# Altium schematic sheet DDS.SchDoc
size A2
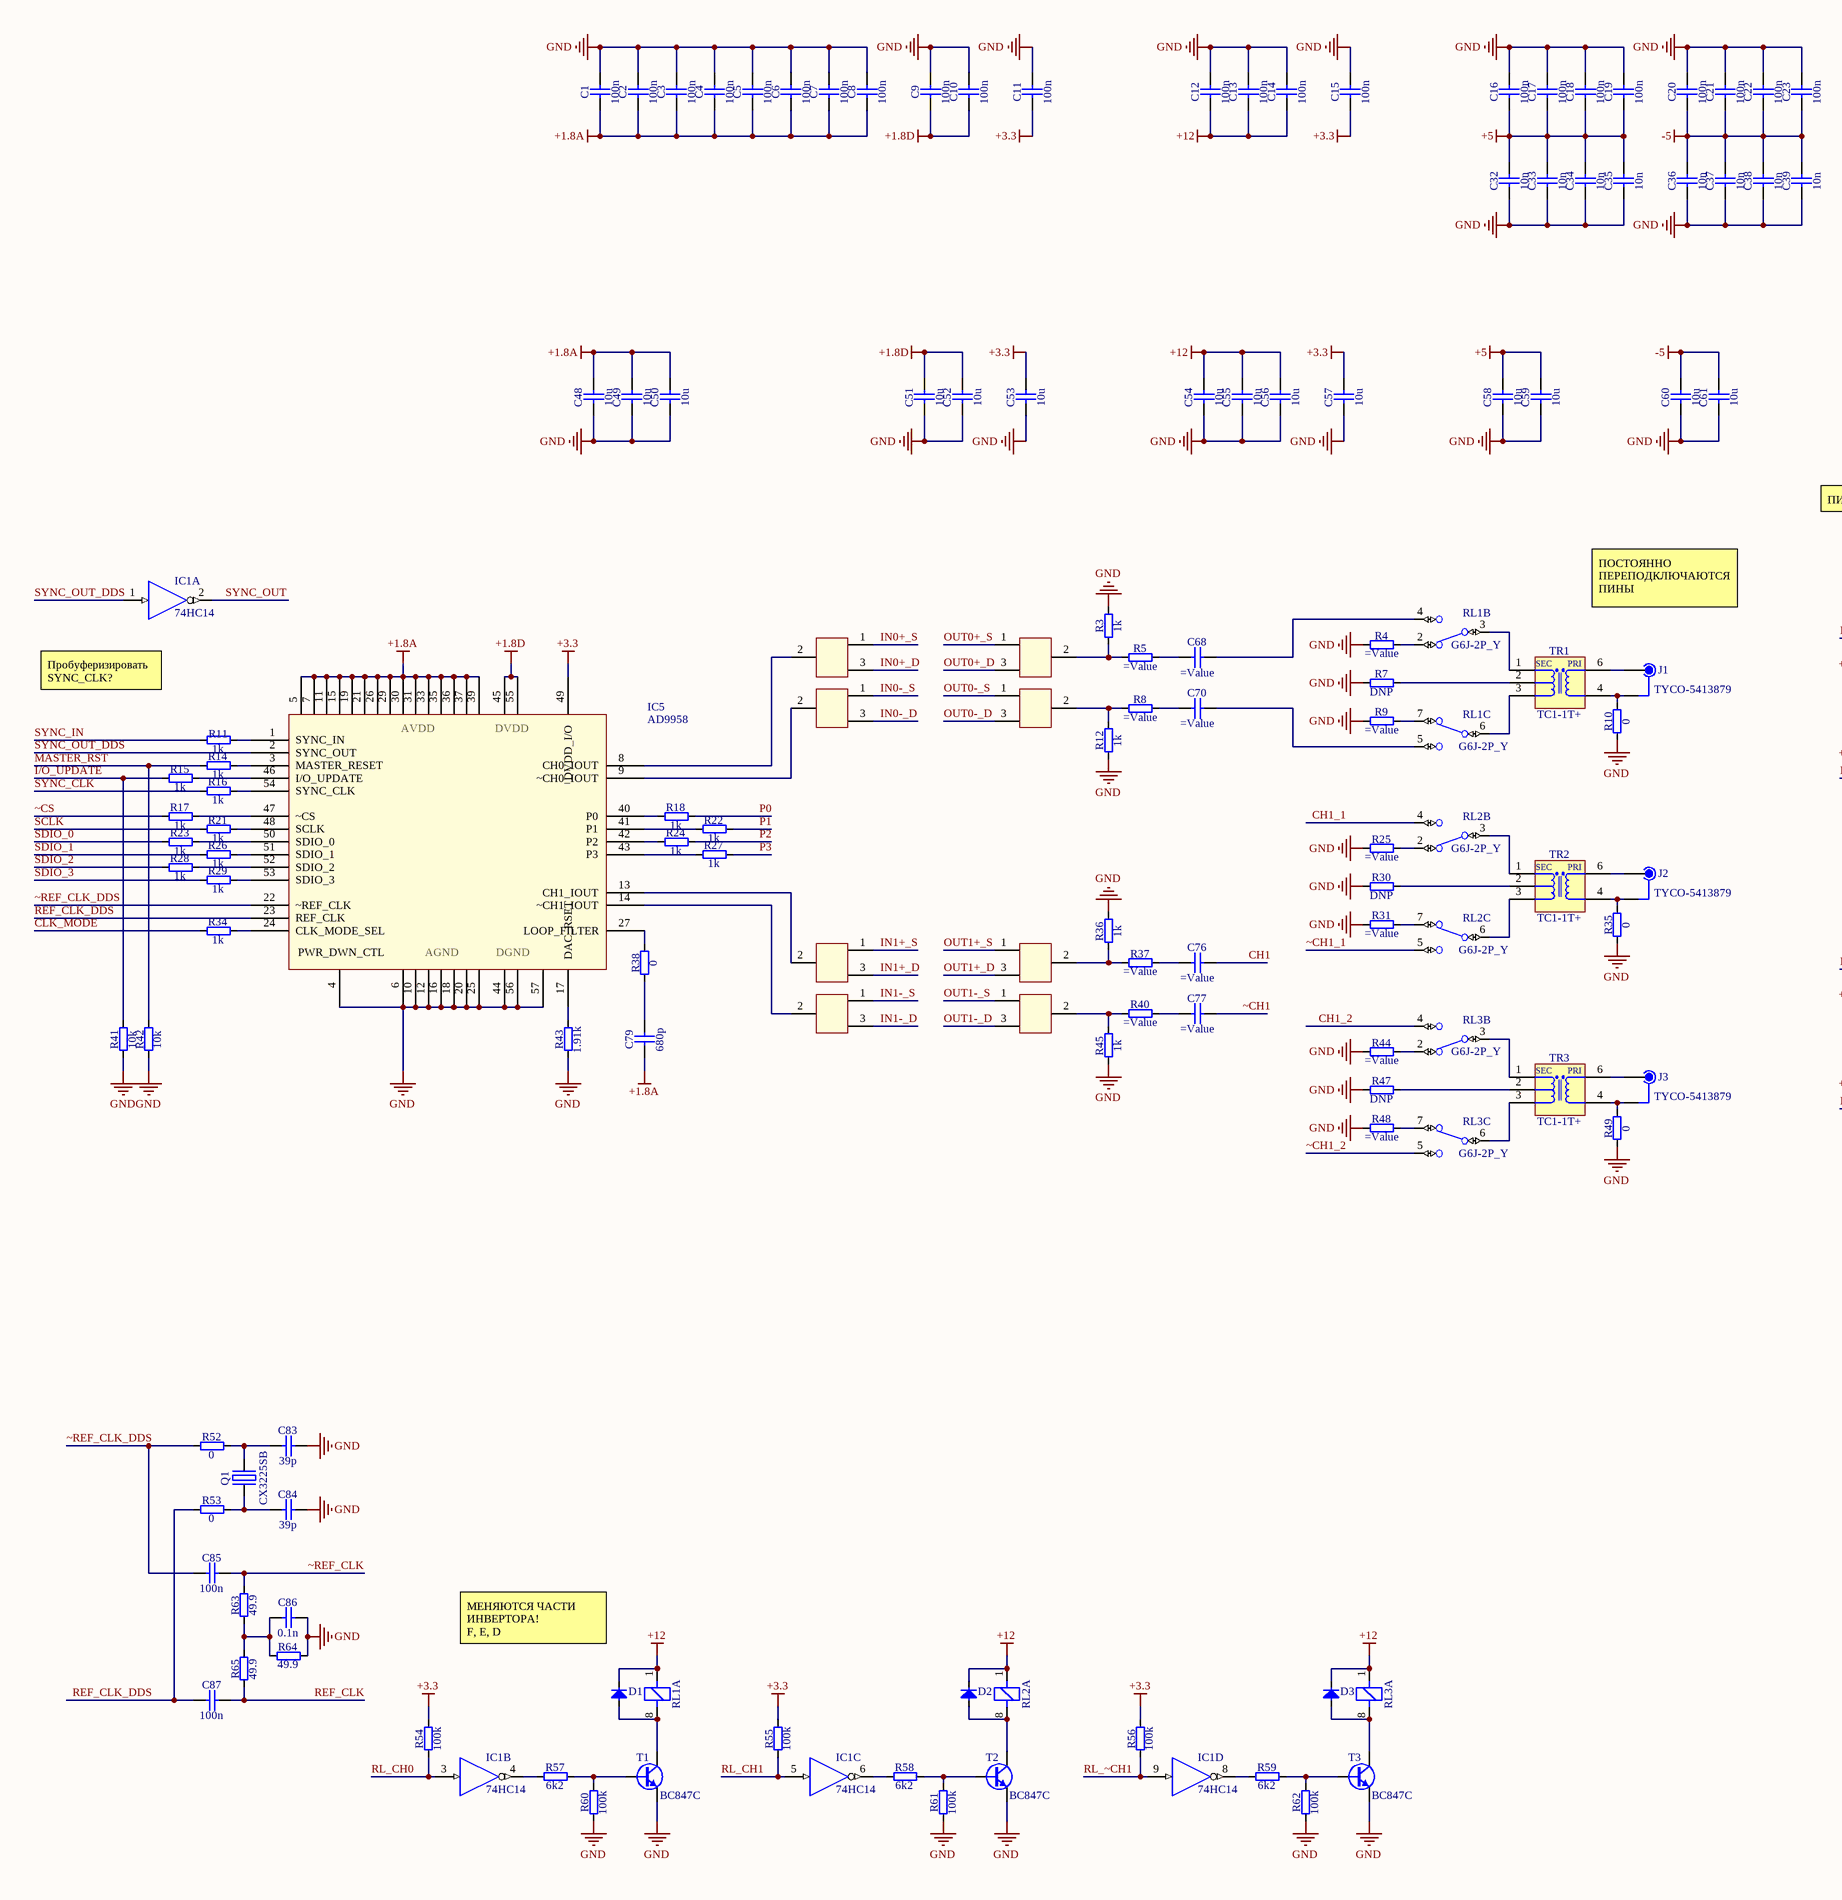
[diagram p0: DDS.SchDoc, left]
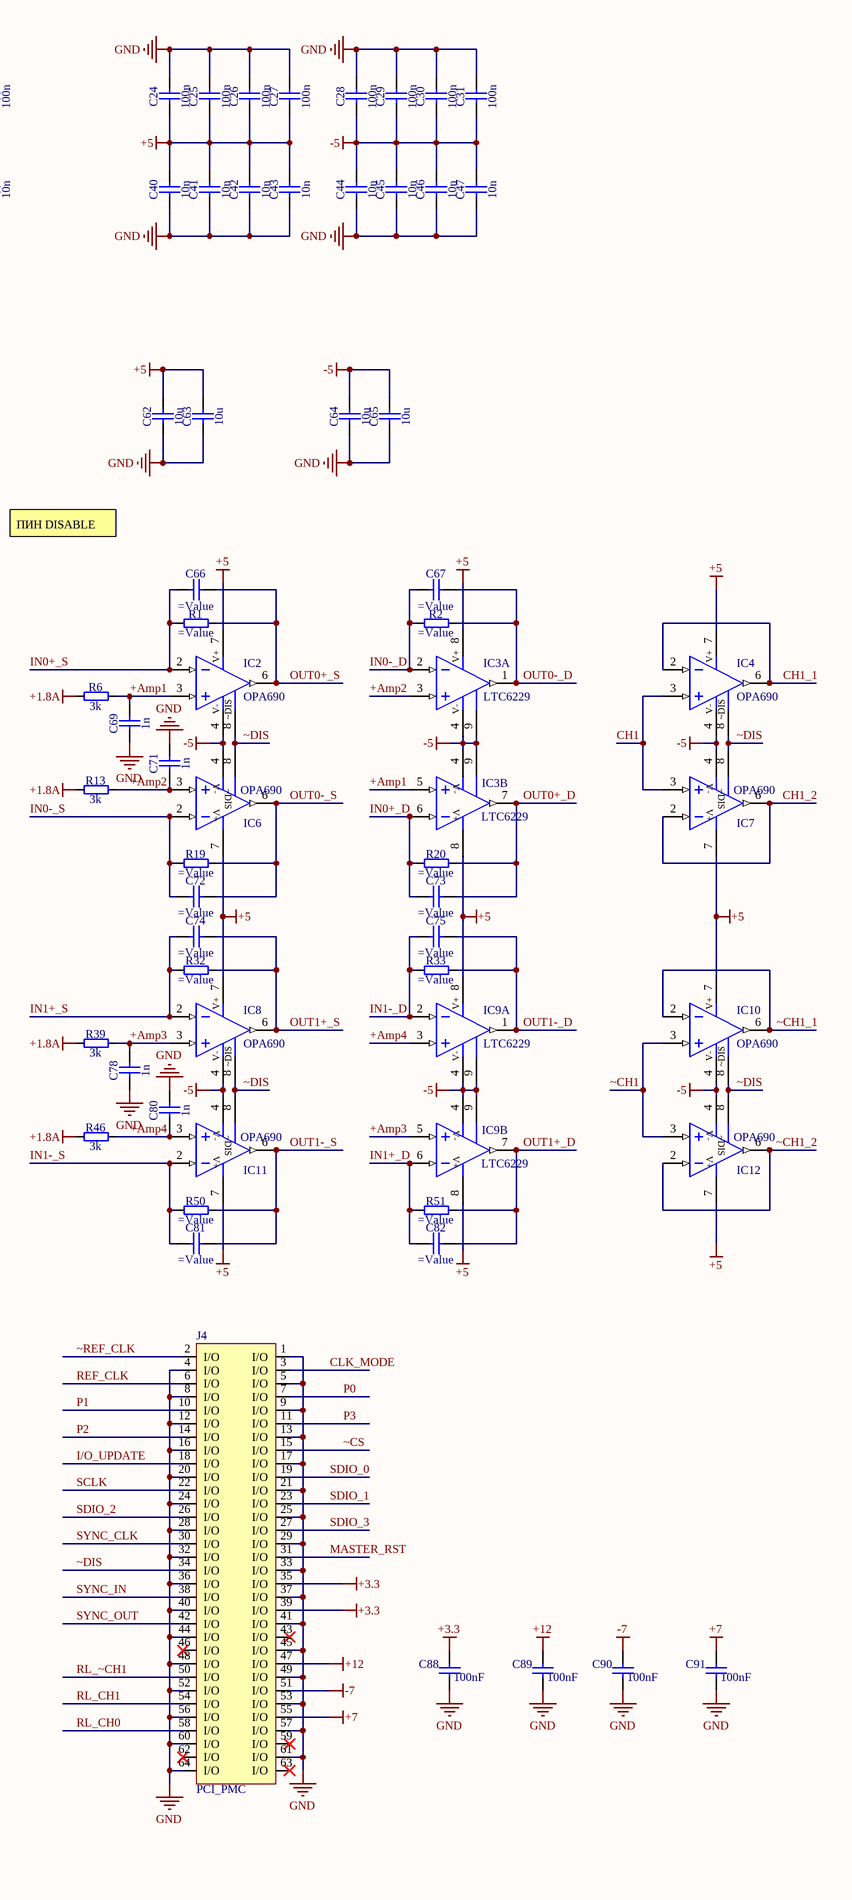
[diagram p1: DDS.SchDoc, right]

## Parts
1  Jumper  [Jumper]  (value not drawn)
2  Jumper  [Jumper]  (value not drawn)
3  Jumper  [Jumper]  (value not drawn)
4  Jumper  [Jumper]  (value not drawn)
5  Jumper  [Jumper]  (value not drawn)
6  Jumper  [Jumper]  (value not drawn)
7  Jumper  [Jumper]  (value not drawn)
8  Jumper  [Jumper]  (value not drawn)
C1  100n  [0603]
C2  100n  [0603]
C3  100n  [0603]
C4  100n  [0603]
C5  100n  [0603]
C6  100n  [0603]
C7  100n  [0603]
C8  100n  [0603]
C9  100n  [0603]
C10  100n  [0603]
C11  100n  [0603]
C12  100n  [0603]
C13  100n  [0603]
C14  100n  [0603]
C15  100n  [0603]
C16  100n  [0603]
C17  100n  [0603]
C18  100n  [0603]
C19  100n  [0603]
C20  100n  [0603]
C21  100n  [0603]
C22  100n  [0603]
C23  100n  [0603]
C24  100n  [0603]
C25  100n  [0603]
C26  100n  [0603]
C27  100n  [0603]
C28  100n  [0603]
C29  100n  [0603]
C30  100n  [0603]
C31  100n  [0603]
C32  10n  [0603]
C33  10n  [0603]
C34  10n  [0603]
C35  10n  [0603]
C36  10n  [0603]
C37  10n  [0603]
C38  10n  [0603]
C39  10n  [0603]
C40  10n  [0603]
C41  10n  [0603]
C42  10n  [0603]
C43  10n  [0603]
C44  10n  [0603]
C45  10n  [0603]
C46  10n  [0603]
C47  10n  [0603]
C48  10u  [0603]
C49  10u  [0603]
C50  10u  [0603]
C51  10u  [0603]
C52  10u  [0603]
C53  10u  [0603]
C54  10u  [0603]
C55  10u  [0603]
C56  10u  [0603]
C57  10u  [0603]
C58  10u  [0603]
C59  10u  [0603]
C60  10u  [0603]
C61  10u  [0603]
C62  10u  [0603]
C63  10u  [0603]
C64  10u  [0603]
C65  10u  [0603]
C66  (no value)  [0805]
C67  (no value)  [0805]
C68  (no value)  [0603]
C69  1n  [0603]
C70  (no value)  [0603]
C71  1n  [0603]
C72  (no value)  [0805]
C73  (no value)  [0805]
C74  (no value)  [0805]
C75  (no value)  [0805]
C76  (no value)  [0603]
C77  (no value)  [0603]
C78  1n  [0603]
C79  680p  [0603]
C80  1n  [0603]
C81  (no value)  [0805]
C82  (no value)  [0805]
C83  39p  [0603]
C84  39p  [0603]
C85  100n  [0603]
C86  0.1n  [0805]
C87  100n  [0603]
C88  100nF  [0805]
C89  100nF  [0805]
C90  100nF  [0805]
C91  100nF  [0805]
D1  Diode  [SODFL1608X65N]  (value not drawn)
D2  Diode  [SODFL1608X65N]  (value not drawn)
D3  Diode  [SODFL1608X65N]  (value not drawn)
IC1  74HC14  [SOIC127P600X175-14N]  (parts A,B,C,D of 6)
IC2  OPA690  [SOIC127P600X175-8N]
IC3  LTC6229  [SOP65P490X110-9N-R168X188]  (parts A,B of 2)
IC4  OPA690  [SOIC127P600X175-8N]
IC5  AD9958  [QFN50P800X800X80-57N-S670]
IC6  OPA690  [SOIC127P600X175-8N]
IC7  OPA690  [SOIC127P600X175-8N]
IC8  OPA690  [SOIC127P600X175-8N]
IC9  LTC6229  [SOP65P490X110-9N-R168X188]  (parts A,B of 2)
IC10  OPA690  [SOIC127P600X175-8N]
IC11  OPA690  [SOIC127P600X175-8N]
IC12  OPA690  [SOIC127P600X175-8N]
J1  TYCO-5413879  [TYCO_1-5413879]
J2  TYCO-5413879  [TYCO_1-5413879]
J3  TYCO-5413879  [TYCO_1-5413879]
J4  PCI_PMC  [TYCO_120527-1]
Q1  CX3225SB  [XTAL_KYOCERA_CX3225SB]
R1  (no value)  [0805]
R2  (no value)  [0805]
R3  1k  [0603]
R4  (no value)  [0603]
R5  (no value)  [0603]
R6  3k  [0603]
R7  DNP  [0603]
R8  (no value)  [0603]
R9  (no value)  [0603]
R10  0  [0603]
R11  1k  [0603]
R12  1k  [0603]
R13  3k  [0603]
R14  1k  [0603]
R15  1k  [0603]
R16  1k  [0603]
R17  1k  [0603]
R18  1k  [0603]
R19  (no value)  [0805]
R20  (no value)  [0805]
R21  1k  [0603]
R22  1k  [0603]
R23  1k  [0603]
R24  1k  [0603]
R25  (no value)  [0603]
R26  1k  [0603]
R27  1k  [0603]
R28  1k  [0603]
R29  1k  [0603]
R30  DNP  [0603]
R31  (no value)  [0603]
R32  (no value)  [0805]
R33  (no value)  [0805]
R34  1k  [0603]
R35  0  [0603]
R36  1k  [0603]
R37  (no value)  [0603]
R38  0  [0603]
R39  3k  [0603]
R40  (no value)  [0603]
R41  10k  [0603]
R42  10k  [0603]
R43  1.91k  [0603]
R44  (no value)  [0603]
R45  1k  [0603]
R46  3k  [0603]
R47  DNP  [0603]
R48  (no value)  [0603]
R49  0  [0603]
R50  (no value)  [0805]
R51  (no value)  [0805]
R52  0  [0603]
R53  0  [0603]
R54  100k  [0603]
R55  100k  [0603]
R56  100k  [0603]
R57  6k2  [0805]
R58  6k2  [0805]
R59  6k2  [0805]
R60  100k  [0603]
R61  100k  [0603]
R62  100k  [0603]
R63  49.9  [0805]
R64  49.9  [0805]
R65  49.9  [0805]
RL1  G6J-2P_Y  [G6J-2P-Y]  (value not drawn)  (parts A,B,C of 3)
RL2  G6J-2P_Y  [G6J-2P-Y]  (value not drawn)  (parts A,B,C of 3)
RL3  G6J-2P_Y  [G6J-2P-Y]  (value not drawn)  (parts A,B,C of 3)
T1  BC847C  [SOT95P230X110-3N]
T2  BC847C  [SOT95P230X110-3N]
T3  BC847C  [SOT95P230X110-3N]
TR1  TC1-1T+  [AT224-1]
TR2  TC1-1T+  [AT224-1]
TR3  TC1-1T+  [AT224-1]

## Nets
+1.8A: C1.1 C2.1 C3.1 C4.1 C5.1 C6.1 C7.1 C8.1 C48.2 C49.2 C50.2 C79.1 IC5.5 IC5.7 IC5.11 IC5.15 IC5.19 IC5.21 IC5.26 IC5.29 IC5.30 IC5.31 IC5.33 IC5.35 IC5.36 IC5.37 IC5.39 R6.1 R13.1 R39.1 R46.1
+1.8D: C9.1 C10.1 C51.2 C52.2 IC5.45 IC5.55
+3.3: C11.1 C15.1 C53.2 C57.2 C88.2 IC1.14(VCC) IC5.49(DVDD_I/O) J4.35(I/O) J4.39(I/O) R54.2 R55.2 R56.2
+5: C16.1 C17.1 C18.1 C19.1 C24.1 C25.1 C26.1 C27.1 C32.2 C33.2 C34.2 C35.2 C40.2 C41.2 C42.2 C43.2 C58.2 C59.2 C62.2 C63.2 IC2.7(V+) IC3.8(V+) IC4.7(V+) IC6.7(V+) IC7.7(V+) IC8.7(V+) IC9.8(V+) IC10.7(V+) IC11.7(V+) IC12.7(V+)
+7: C91.2 J4.55(I/O)
+12: C12.1 C13.1 C14.1 C54.2 C55.2 C56.2 C89.2 D1.1(C) D2.1(C) D3.1(C) J4.47(I/O) RL1.1 RL2.1 RL3.1
-5: C20.1 C21.1 C22.1 C23.1 C28.1 C29.1 C30.1 C31.1 C36.2 C37.2 C38.2 C39.2 C44.2 C45.2 C46.2 C47.2 C60.2 C61.2 C64.2 C65.2 IC2.4(V-) IC3.4(V-) IC3.9 IC4.4(V-) IC6.4(V-) IC7.4(V-) IC8.4(V-) IC9.4(V-) IC9.9 IC10.4(V-) IC11.4(V-) IC12.4(V-)
-7: C90.2 J4.51(I/O)
GND: C1.2 C2.2 C3.2 C4.2 C5.2 C6.2 C7.2 C8.2 C9.2 C10.2 C11.2 C12.2 C13.2 C14.2 C15.2 C16.2 C17.2 C18.2 C19.2 C20.2 C21.2 C22.2 C23.2 C24.2 C25.2 C26.2 C27.2 C28.2 C29.2 C30.2 C31.2 C32.1 C33.1 C34.1 C35.1 C36.1 C37.1 C38.1 C39.1 C40.1 C41.1 C42.1 C43.1 C44.1 C45.1 C46.1 C47.1 C48.1 C49.1 C50.1 C51.1 C52.1 C53.1 C54.1 C55.1 C56.1 C57.1 C58.1 C59.1 C60.1 C61.1 C62.1 C63.1 C64.1 C65.1 C69.1 C71.2 C78.1 C80.2 C83.2 C84.2 C86.2 C88.1 C89.1 C90.1 C91.1 IC1.7(GND) IC5.4(PWR_DWN_CTL) IC5.6 IC5.10 IC5.12 IC5.16 IC5.18 IC5.20 IC5.25 IC5.44 IC5.56 IC5.57 J1.2 J2.2 J3.2 J4.1(I/O) J4.4(I/O) J4.5(I/O) J4.8(I/O) J4.9(I/O) J4.12(I/O) J4.13(I/O) J4.16(I/O) J4.17(I/O) J4.20(I/O) J4.21(I/O) J4.24(I/O) J4.25(I/O) J4.28(I/O) J4.29(I/O) J4.32(I/O) J4.33(I/O) J4.36(I/O) J4.37(I/O) J4.40(I/O) J4.41(I/O) J4.44(I/O) J4.45(I/O) J4.48(I/O) J4.49(I/O) J4.52(I/O) J4.53(I/O) J4.56(I/O) J4.57(I/O) J4.60(I/O) J4.61(I/O) J4.64(I/O) Q1.2(GND) Q1.4(GND) R3.2 R4.1 R7.1 R9.1 R10.1 R12.1 R25.1 R30.1 R31.1 R35.1 R36.2 R41.1 R42.1 R43.1 R44.1 R45.1 R47.1 R48.1 R49.1 R60.1 R61.1 R62.1 R64.2 T1.2(E) T2.2(E) T3.2(E)
+Amp1: C69.2 IC2.3(IN+) IC3.5(IN+) R6.2
+Amp2: C71.1 IC3.3(IN+) IC6.3(IN+) R13.2
+Amp3: C78.2 IC8.3(IN+) IC9.5(IN+) R39.2
+Amp4: C80.1 IC9.3(IN+) IC11.3(IN+) R46.2
CH1: C76.2 IC4.3(IN+) IC7.3(IN+)
CH1_1: IC4.2(IN-) IC4.6(OUT) RL2.4(NO)
CH1_2: IC7.2(IN-) IC7.6(OUT) RL3.4(NO)
CLK_MODE: J4.3(I/O) R34.1
I/O_UPDATE: J4.18(I/O) R15.1 R41.2
IN0+_D: 1.3 C73.1 IC3.6(IN-) R20.1
IN0+_S: 1.1 C66.1 IC2.2(IN-) R1.1
IN0-_D: 3.3 C67.1 IC3.2(IN-) R2.1
IN0-_S: 3.1 C72.1 IC6.2(IN-) R19.1
IN1+_D: 5.3 C82.1 IC9.6(IN-) R51.1
IN1+_S: 5.1 C74.1 IC8.2(IN-) R32.1
IN1-_D: 7.3 C75.1 IC9.2(IN-) R33.1
IN1-_S: 7.1 C81.1 IC11.2(IN-) R50.1
MASTER_RST: J4.31(I/O) R14.1 R42.2
OUT0+_D: 2.3 C73.2 IC3.7(OUT) R20.2
OUT0+_S: 2.1 C66.2 IC2.6(OUT) R1.2
OUT0-_D: 4.3 C67.2 IC3.1(OUT) R2.2
OUT0-_S: 4.1 C72.2 IC6.6(OUT) R19.2
OUT1+_D: 6.3 C82.2 IC9.7(OUT) R51.2
OUT1+_S: 6.1 C74.2 IC8.6(OUT) R32.2
OUT1-_D: 8.3 C75.2 IC9.1(OUT) R33.2
OUT1-_S: 8.1 C81.2 IC11.6(OUT) R50.2
P0: J4.7(I/O) R18.2
P1: J4.10(I/O) R22.2
P2: J4.14(I/O) R24.2
P3: J4.11(I/O) R27.2
REF_CLK: C87.2 J4.6(I/O) R65.1
REF_CLK_DDS: C87.1 IC5.23(REF_CLK) R53.1
RL_CH0: IC1.3(IN) J4.58(I/O) R54.1
RL_CH1: IC1.5(IN) J4.54(I/O) R55.1
RL_~CH1: IC1.9(IN) J4.50(I/O) R56.1
SCLK: J4.22(I/O) R21.1
SDIO_0: J4.19(I/O) R23.1
SDIO_1: J4.23(I/O) R26.1
SDIO_2: J4.26(I/O) R28.1
SDIO_3: J4.27(I/O) R29.1
SYNC_CLK: J4.30(I/O) R16.1
SYNC_IN: J4.38(I/O) R11.1
SYNC_OUT: IC1.2(OUT) J4.42(I/O)
SYNC_OUT_DDS: IC1.1(IN) IC5.2(SYNC_OUT)
~CH1: C77.2 IC10.3(IN+) IC12.3(IN+)
~CH1_1: IC10.2(IN-) IC10.6(OUT) RL2.5(NO)
~CH1_2: IC12.2(IN-) IC12.6(OUT) RL3.5(NO)
~CS: J4.15(I/O) R17.1
~DIS: IC2.8(~DIS) IC4.8(~DIS) IC6.8(~DIS) IC7.8(~DIS) IC8.8(~DIS) IC10.8(~DIS) IC11.8(~DIS) IC12.8(~DIS) J4.34(I/O)
~REF_CLK: C85.2 J4.2(I/O) R63.2
~REF_CLK_DDS: C85.1 IC5.22(~REF_CLK) R52.1
Net1_2: 1.2 IC5.8(CH0_IOUT)
Net2_2: 2.2 R3.1 R5.1
Net3_2: 3.2 IC5.9(~CH0_IOUT)
Net4_2: 4.2 R8.1 R12.2
Net5_2: 5.2 IC5.13(CH1_IOUT)
Net6_2: 6.2 R36.1 R37.1
Net7_2: 7.2 IC5.14(~CH1_IOUT)
Net8_2: 8.2 R40.1 R45.2
NetC68_1: C68.1 R5.2
NetC68_2: C68.2 RL1.4(NO)
NetC70_1: C70.1 R8.2
NetC70_2: C70.2 RL1.5(NO)
NetC76_1: C76.1 R37.2
NetC77_1: C77.1 R40.2
NetC79_2: C79.2 R38.1
NetC83_1: C83.1 Q1.3(OSC2) R52.2
NetC84_1: C84.1 Q1.1(OSC1) R53.2
NetC86_1: C86.1 R63.1 R64.1 R65.2
NetD1_2: D1.2(A) RL1.8 T1.3(C)
NetD2_2: D2.2(A) RL2.8 T2.3(C)
NetD3_2: D3.2(A) RL3.8 T3.3(C)
NetIC1_4: IC1.4(OUT) R57.1
NetIC1_6: IC1.6(OUT) R58.1
NetIC1_8: IC1.8(OUT) R59.1
NetIC5_1: IC5.1(SYNC_IN) R11.2
NetIC5_3: IC5.3(MASTER_RESET) R14.2
NetIC5_17: IC5.17(DAC_RSET) R43.2
NetIC5_24: IC5.24(CLK_MODE_SEL) R34.2
NetIC5_27: IC5.27(LOOP_FILTER) R38.2
NetIC5_40: IC5.40(P0) R18.1
NetIC5_41: IC5.41(P1) R22.1
NetIC5_42: IC5.42(P2) R24.1
NetIC5_43: IC5.43(P3) R27.1
NetIC5_46: IC5.46(I/O_UPDATE) R15.2
NetIC5_47: IC5.47(~CS) R17.2
NetIC5_48: IC5.48(SCLK) R21.2
NetIC5_50: IC5.50(SDIO_0) R23.2
NetIC5_51: IC5.51(SDIO_1) R26.2
NetIC5_52: IC5.52(SDIO_2) R28.2
NetIC5_53: IC5.53(SDIO_3) R29.2
NetIC5_54: IC5.54(SYNC_CLK) R16.2
NetJ1_1: J1.1 TR1.6(PDOT)
NetJ1_2: J1.2 R10.2 TR1.4(P)
NetJ2_1: J2.1 TR2.6(PDOT)
NetJ2_2: J2.2 R35.2 TR2.4(P)
NetJ3_1: J3.1 TR3.6(PDOT)
NetJ3_2: J3.2 R49.2 TR3.4(P)
NetR4_2: R4.2 RL1.2(NC)
NetR7_2: R7.2 TR1.2(NC)
NetR9_2: R9.2 RL1.7(NC)
NetR25_2: R25.2 RL2.2(NC)
NetR30_2: R30.2 TR2.2(NC)
NetR31_2: R31.2 RL2.7(NC)
NetR44_2: R44.2 RL3.2(NC)
NetR47_2: R47.2 TR3.2(NC)
NetR48_2: R48.2 RL3.7(NC)
NetR57_2: R57.2 R60.2 T1.1(B)
NetR58_2: R58.2 R61.2 T2.1(B)
NetR59_2: R59.2 R62.2 T3.1(B)
NetRL1_3: RL1.3(C) TR1.1(SDOT)
NetRL1_6: RL1.6(C) TR1.3(S)
NetRL2_3: RL2.3(C) TR2.1(SDOT)
NetRL2_6: RL2.6(C) TR2.3(S)
NetRL3_3: RL3.3(C) TR3.1(SDOT)
NetRL3_6: RL3.6(C) TR3.3(S)

Not connected (* = marked no-connect by the designer): J4 43(I/O)* 46(I/O)* 59(I/O)* 62(I/O)* 63(I/O)*

## Notes on the sheet
- ПИН DISABLE
- ПОСТОЯННО ПЕРЕПОДКЛЮЧАЮТСЯ ПИНЫ
- Пробуферизировать SYNC_CLK?
- МЕНЯЮТСЯ ЧАСТИ ИНВЕРТОРА!
  F, E, D
- (in symbol DDS) AVDD; DVDD; AGND; DGND
- (in symbol Transformer) SEC; PRI

## Library data of the parts
1-8 = Jumper: 0805
C1-C91 = Capacitor
D1-D3 = Diode: Vendor: CTK; Voltage: 30V; SMD Solders: 2; Solder Option: RM; Pkg: SOD523; Device: RB521S-30; Price: 5; Name to order: RB521S-30
IC1 = Hex Inverters: 6 HEX inverters with Schmitt trigger inputs
IC2 IC4 IC6-IC8 IC10-IC12 = Single Op Amp: Wideband, Voltage-Feedback Operational Amplifier With Disable
IC3 IC9 = Dual Op Amp: 0.88nV/√Hz 730MHz, 500V/µs, Low Distortion Rail-to-Rail Output Op Amps with Shutdown
IC5 = DDS: 2-Channel, 500 MSPS DDS with 10-Bit DACs
J1-J3 = Coax
J4 = PCI_PMC: PCI Mezzanine Connector; IEEE 1386 Mezzanine board; Manufactuer: TE Connectivity; PartField: 120527-1; SolderOption: 2; Pkg: PMC Male (IEEE 1386); Value: PCI_PMC; Vendor: TE Connectivity
Q1 = Quartz Crystal: 25 MHz
R1-R65 = Resistor
RL1-RL3 = Relay: Ultra-compact and Slim DPDT Relay
T1-T3 = NPN Transistor: NPN
TR1-TR3 = Transformer: 50 Ohms 0.4 to 500MHz RF Transformer